# EAGLE schematic ecu1_telemetria (EAGLE 9.0.0)
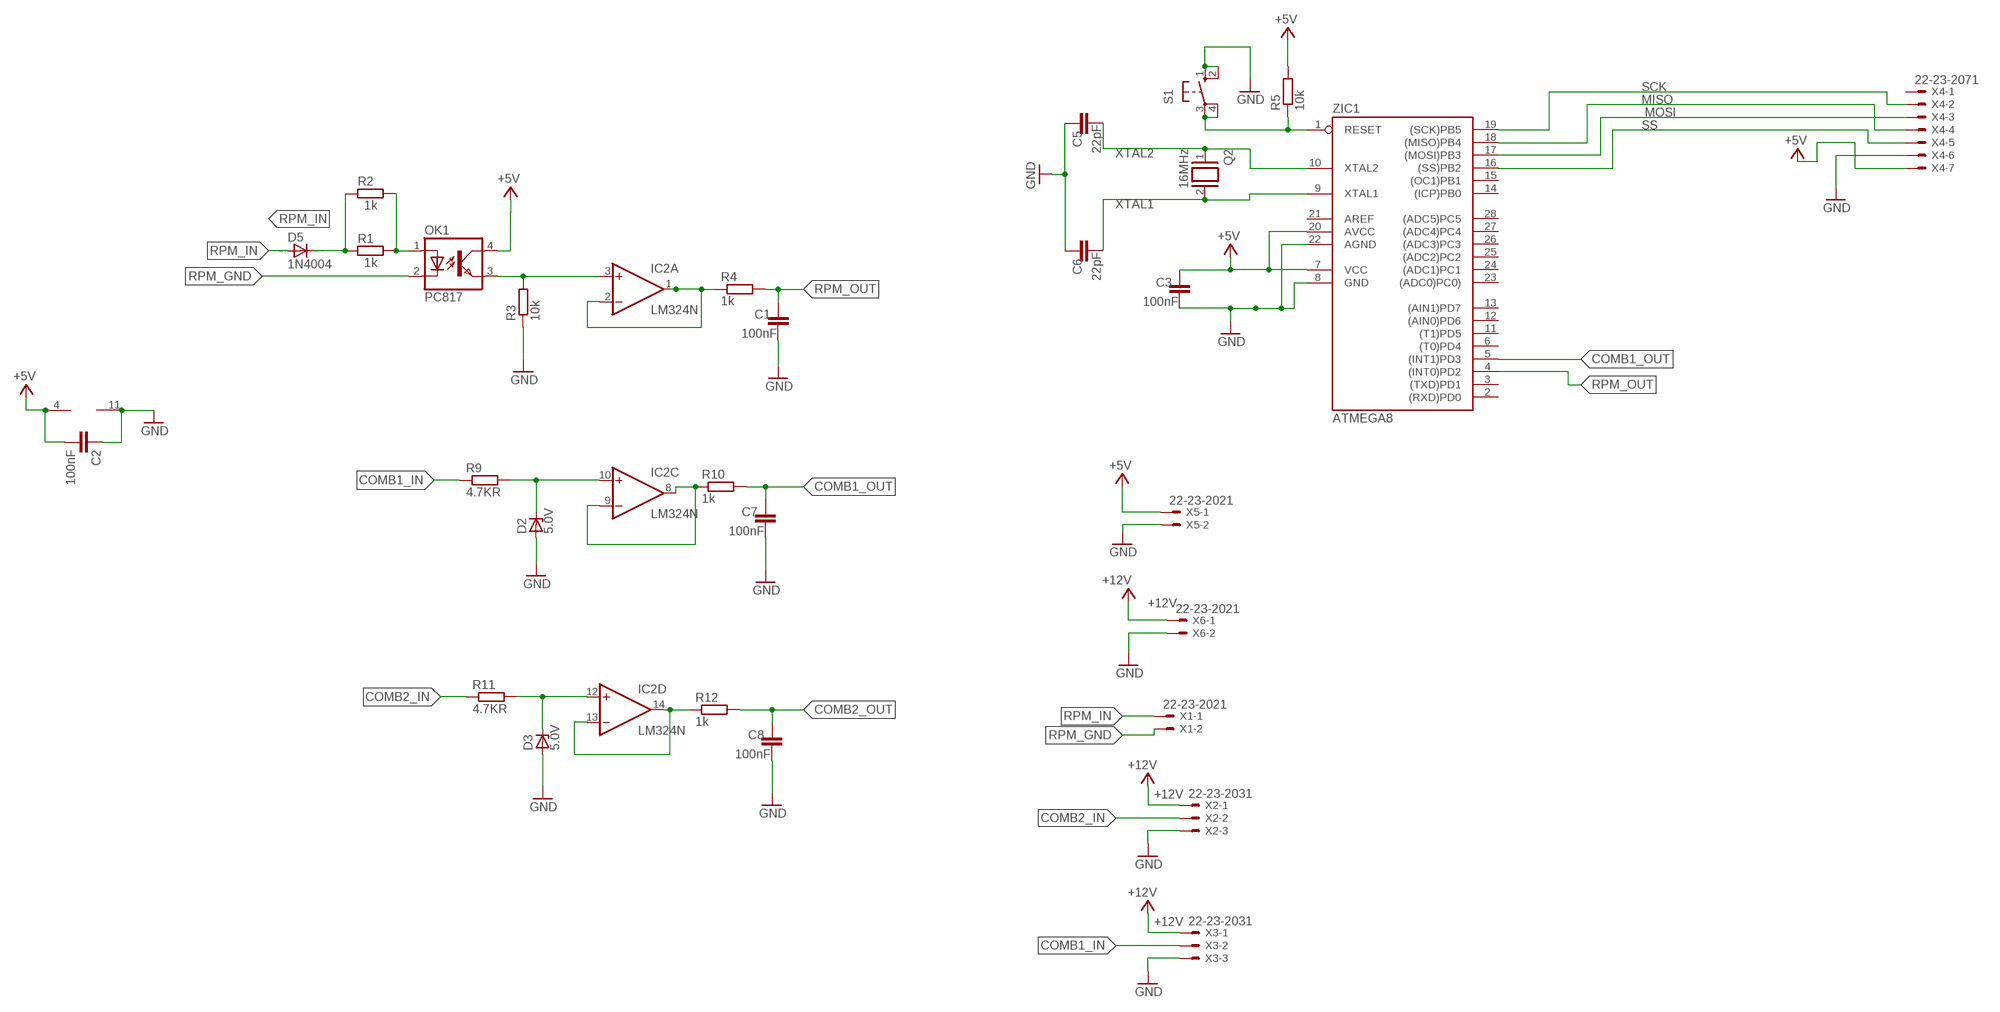
[diagram p0: schematic, sheet 1]

## Parts
C1  100nF  C5/2.5  [C5B2.5]
C2  100nF  C2,5-3  [C2.5-3]
C3  100nF  C5/2.5  [C5B2.5]
C5  22pF  C5/2.5  [C5B2.5]
C6  22pF  C5/2.5  [C5B2.5]
C7  100nF  C5/2.5  [C5B2.5]
C8  100nF  C5/2.5  [C5B2.5]
D2  5.0V  ZENER-DIODEDO34-7  [DO34Z7]
D3  5.0V  ZENER-DIODEDO34-7  [DO34Z7]
D5  1N4004  [DO41-10]
IC2  LM324N  [DIL14]
OK1  PC817  [DIL04]
Q2  16MHz  XTAL/S  [QS]
R1  1k  R-EU_0207/7  [0207/7]
R2  1k  R-EU_0207/7  [0207/7]
R3  10k  R-EU_0207/7  [0207/7]
R4  1k  R-EU_0207/7  [0207/7]
R5  10k  R-EU_0207/7  [0207/7]
R9  4.7KR  R-EU_0207/7  [0207/7]
R10  1k  R-EU_0207/7  [0207/7]
R11  4.7KR  R-EU_0207/7  [0207/7]
R12  1k  R-EU_0207/7  [0207/7]
S1  10-XX  [B3F-10XX]
X1  22-23-2021  [22-23-2021]
X2  22-23-2031  [22-23-2031]
X3  22-23-2031  [22-23-2031]
X4  22-23-2071  [22-23-2071]
X5  22-23-2021  [22-23-2021]
X6  22-23-2021  [22-23-2021]
ZIC1  ATMEGA8  AT90S4433P  [DIL28-3]

## Nets
+5V: C2.2 C3.2 IC2.4(P:V+) OK1.4(COL) R5.2 X4.7 X5.1 ZIC1.7(VCC) ZIC1.20(AVCC)
+12V: X2.1 X3.1 X6.1
COMB1_IN: R9.1 X3.2
COMB1_OUT: C7.2 R10.2 ZIC1.5((INT1)PD3)
COMB2_IN: R11.1 X2.2
COMB2_OUT: C8.2 R12.2
GND: C1.1 C2.1 C3.1 C5.2 C6.2 C7.1 C8.1 D2.A D3.A IC2.11(P:V-) R3.1 S1.1(S) S1.2(S1) X2.3 X3.3 X4.6 X5.2 X6.2 ZIC1.8(GND) ZIC1.22(AGND)
MISO: X4.4 ZIC1.18((MISO)PB4)
MOSI: X4.3 ZIC1.17((MOSI)PB3)
N$1: OK1.1(A) R1.2 R2.2
N$2: D5.C R1.1 R2.1
N$3: IC2.1(A:OUT) IC2.2(A:-IN) R4.1
N$5: D2.C IC2.10(C:+IN) R9.2
N$7: IC2.3(A:+IN) OK1.3(EMIT) R3.2
N$9: R5.1 S1.3(P) S1.4(P1) ZIC1.1(RESET)
N$12: IC2.8(C:OUT) IC2.9(C:-IN) R10.1
N$13: D3.C IC2.12(D:+IN) R11.2
N$14: IC2.13(D:-IN) IC2.14(D:OUT) R12.1
RPM_GND: OK1.2(C) X1.2
RPM_IN: D5.A X1.1
RPM_OUT: C1.2 R4.2 ZIC1.4((INT0)PD2)
SCK: X4.2 ZIC1.19((SCK)PB5)
SS: X4.5 ZIC1.16((SS)PB2)
XTAL1: C6.1 Q2.2 ZIC1.9(XTAL1)
XTAL2: C5.1 Q2.1 ZIC1.10(XTAL2)
Unconnected: IC2.5(B:+IN) IC2.6(B:-IN) IC2.7(B:OUT) X4.1 ZIC1.2((RXD)PD0) ZIC1.3((TXD)PD1) ZIC1.6((T0)PD4) ZIC1.11((T1)PD5) ZIC1.12((AIN0)PD6) ZIC1.13((AIN1)PD7) ZIC1.14((ICP)PB0) ZIC1.15((OC1)PB1) ZIC1.21(AREF) ZIC1.23((ADC0)PC0)) ZIC1.24((ADC1)PC1) ZIC1.25((ADC2)PC2) ZIC1.26((ADC3)PC3) ZIC1.27((ADC4)PC4) ZIC1.28((ADC5)PC5)

## Library data of the parts
C1-C3 C5-C8 = capacitor-wima:C: CAPACITOR naming: grid - package width
D2 D3 = diode:ZENER-DIODE: Z-Diode
D5 = diode:1N4004: DIODE general purpose rectifier, 1 A
IC2 = linear:LM324: OP AMP
OK1 = optocoupler:PC817: SHARP OPTO COUPLER; MPN: PC817X4J000F; OC_FARNELL: 9707727; OC_NEWARK: 97K7059
Q2 = special:XTAL/S: CRYSTAL
R1-R5 R9-R12 = resistor:R-EU_: RESISTOR, European symbol
S1 = switch-omron:10-XX: OMRON SWITCH; MPN: B3F-1000; OC_FARNELL: 176432; OC_NEWARK: 36M3542
X1 X5 X6 = con-molex:22-23-2021: .100" (2.54mm) Center Header - 2 Pin; MF: MOLEX; MPN: 22-23-2021; OC_FARNELL: 1462926; OC_NEWARK: 25C3832
X2 X3 = con-molex:22-23-2031: .100" (2.54mm) Center Header - 3 Pin; MF: MOLEX; MPN: 22-23-2031; OC_FARNELL: 1462950; OC_NEWARK: 30C0862
X4 = con-molex:22-23-2071: .100" (2.54mm) Center Header - 7 Pin; MF: MOLEX; MPN: 22-23-2071; OC_FARNELL: 1654534; OC_NEWARK: 56H0445
ZIC1 = atmel:AT90S4433: MICROCONTROLLER 4 Kbytes FLASH 128 bytes SRAM 256 bytes EEPROM UART 6-channel 10 bit ADC